# Altium schematic sheet STM32F405.SchDoc
size 406 x 381 mm; SheetNumber: 3; SheetTotal: 3
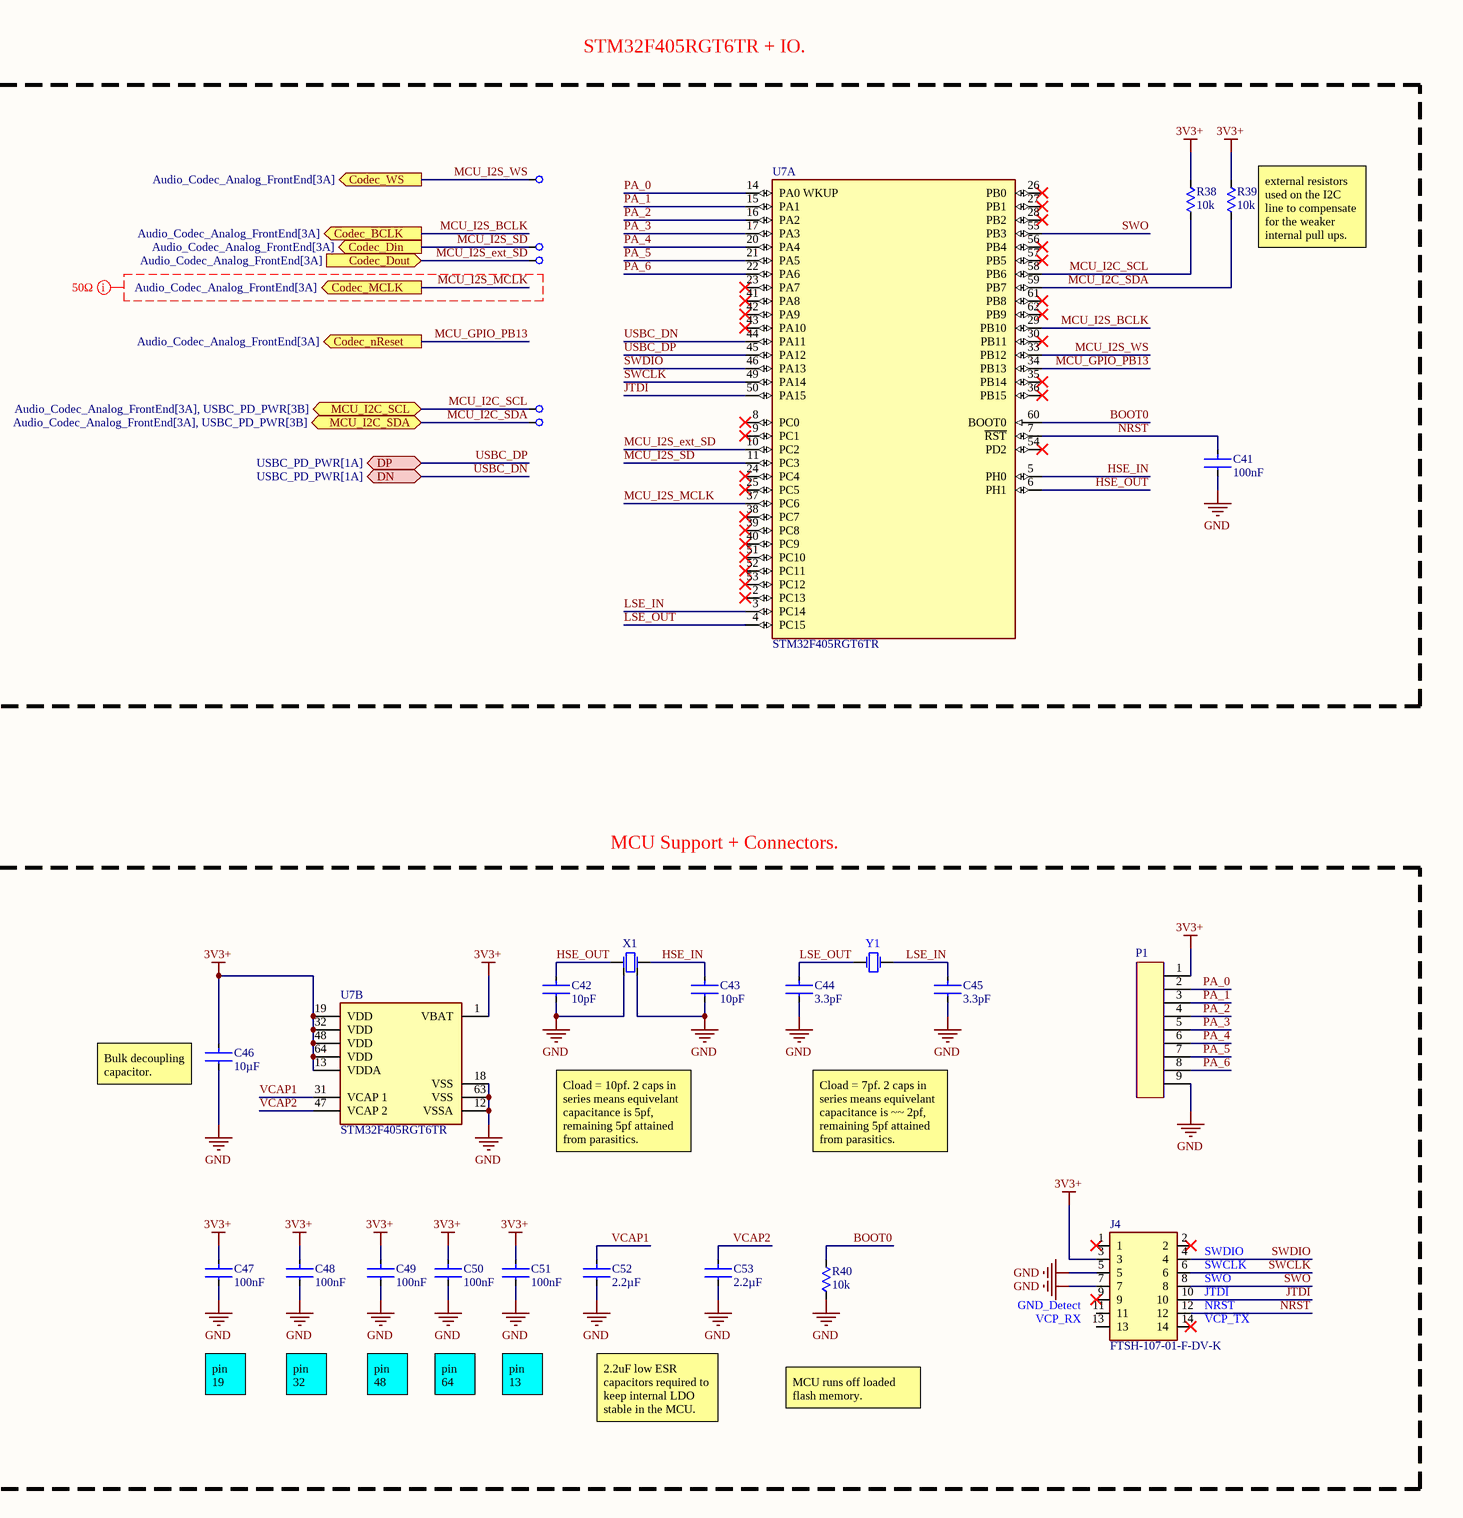
[diagram p0: STM32F405.SchDoc, left]
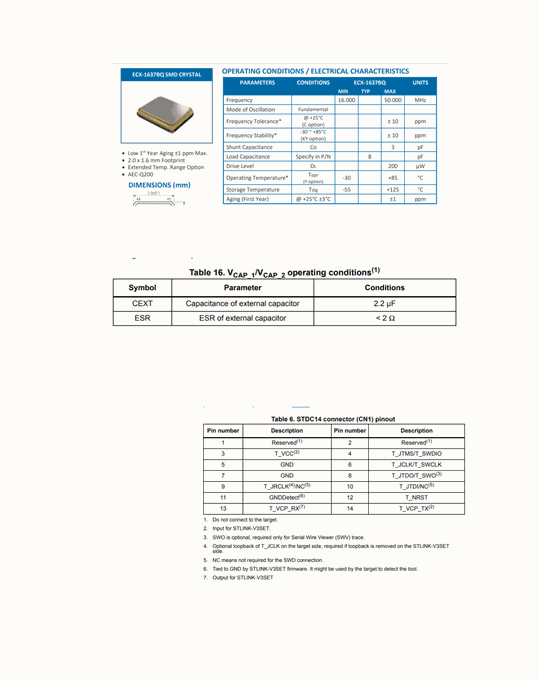
[diagram p1: STM32F405.SchDoc, right]

## Parts
C41  value 100nF  [MURATA-G_M188]  (hidden comment: GCM188R71H104KA57D)
C42  value 10pF  [FP-CL10-MFG]  (hidden comment: CL10C100CB81PNC)
C43  value 10pF  [FP-CL10-MFG]  (hidden comment: CL10C100CB81PNC)
C44  value 3.3pF  [MURATA-G_M188]  (hidden comment: GCM1885C2A3R3CA16D)
C45  value 3.3pF  [MURATA-G_M188]  (hidden comment: GCM1885C2A3R3CA16D)
C46  value 10µF  [MURATA-G_M21B]  (hidden comment: GCM21BC71E106KE36L)
C47  value 100nF  [MURATA-G_M188]  (hidden comment: GCM188R71H104KA57D)
C48  value 100nF  [MURATA-G_M188]  (hidden comment: GCM188R71H104KA57D)
C49  value 100nF  [MURATA-G_M188]  (hidden comment: GCM188R71H104KA57D)
C50  value 100nF  [MURATA-G_M188]  (hidden comment: GCM188R71H104KA57D)
C51  value 100nF  [MURATA-G_M188]  (hidden comment: GCM188R71H104KA57D)
C52  value 2.2µF  [FP-CL10-MFG]  (hidden comment: CL10A225KA8NNNC)
C53  value 2.2µF  [FP-CL10-MFG]  (hidden comment: CL10A225KA8NNNC)
J4  FTSH-107-01-F-DV-K  [FP-FTSH-107-01-F-DV-K-MFG]
P1  61300911121  [61300911121]  (value not drawn)
R38  value 10k  [VISHAY-CRCW0603]  (hidden comment: CRCW060310K0FKTA)
R39  value 10k  [VISHAY-CRCW0603]  (hidden comment: CRCW060310K0FKTA)
R40  value 10k  [VISHAY-CRCW0603]  (hidden comment: CRCW060310K0FKTA)
TP10  Testpoint 1mm  [Testpoint 1mm]  (value not drawn)
TP11  Testpoint 1mm  [Testpoint 1mm]  (value not drawn)
TP12  Testpoint 1mm  [Testpoint 1mm]  (value not drawn)
TP13  Testpoint 1mm  [Testpoint 1mm]  (value not drawn)
TP27  Testpoint 1mm  [Testpoint 1mm]  (value not drawn)
U7  STM32F405RGT6TR  [FP-LQFP64-5W-IPC_C]  (parts A,B of 2)
X1  ECS-250-10-37BQ-CTN-TR  [ECX-1637BQ-ECS]  (value not drawn)
Y1  ECS-.327-7-34QCS-TR  [ECX-34Q-ECS]  (value not drawn)

## Blocks framed on the sheet
MCU Support + Connectors.: C42-C53 J4 P1 R40 U7 X1 Y1

## Ports
Codec_BCLK (out, see Audio_Codec_Analog_FrontEnd[3A]), Codec_Din (out, see Audio_Codec_Analog_FrontEnd[3A]), Codec_Dout (in, see Audio_Codec_Analog_FrontEnd[3A]), Codec_MCLK (out, see Audio_Codec_Analog_FrontEnd[3A]), Codec_nReset (out, see Audio_Codec_Analog_FrontEnd[3A]), Codec_WS (out, see Audio_Codec_Analog_FrontEnd[3A]), DN (bidir, see USBC_PD_PWR[1A]), DP (bidir, see USBC_PD_PWR[1A]), MCU_I2C_SCL (bidir, see Audio_Codec_Analog_FrontEnd[3A], USBC_PD_PWR[3B]), MCU_I2C_SDA (bidir, see Audio_Codec_Analog_FrontEnd[3A], USBC_PD_PWR[3B])

## Nets
3V3+: C46.1 C47.1 C48.1 C49.1 C50.1 C51.1 J4.3 P1.1 R38.2 R39.2 U7.1(VBAT) U7.13(VDDA) U7.19(VDD) U7.32(VDD) U7.48(VDD) U7.64(VDD)
GND: C41.2 C42.2 C43.2 C44.2 C45.2 C46.2 C47.2 C48.2 C49.2 C50.2 C51.2 C52.2 C53.2 J4.5 J4.7 P1.9 R40.2 U7.12(VSSA) U7.18(VSS) U7.63(VSS) X1.2(GND) X1.4(GND)
BOOT0: R40.1 U7.60(BOOT0)
HSE_IN: C43.1 U7.5(PH0) X1.3(Out/In)
HSE_OUT: C42.1 U7.6(PH1) X1.1(In/Out)
JTDI: J4.10 U7.50(PA15)
LSE_IN: C45.1 U7.3(PC14) Y1.2
LSE_OUT: C44.1 U7.4(PC15) Y1.1
MCU_GPIO_PB13: U7.34(PB13) ; port Codec_nReset
MCU_I2C_SCL: R38.1 TP13.1 U7.58(PB6) ; port MCU_I2C_SCL
MCU_I2C_SDA: R39.1 TP27.1 U7.59(PB7) ; port MCU_I2C_SDA
MCU_I2S_BCLK: U7.29(PB10) ; port Codec_BCLK
MCU_I2S_ext_SD: TP12.1 U7.10(PC2) ; port Codec_Dout
MCU_I2S_MCLK: U7.37(PC6) ; port Codec_MCLK
MCU_I2S_SD: TP11.1 U7.11(PC3) ; port Codec_Din
MCU_I2S_WS: TP10.1 U7.33(PB12) ; port Codec_WS
NRST: C41.1 J4.12 U7.7(~{RST})
PA_0: P1.2 U7.14(PA0_WKUP)
PA_1: P1.3 U7.15(PA1)
PA_2: P1.4 U7.16(PA2)
PA_3: P1.5 U7.17(PA3)
PA_4: P1.6 U7.20(PA4)
PA_5: P1.7 U7.21(PA5)
PA_6: P1.8 U7.22(PA6)
SWCLK: J4.6 U7.49(PA14)
SWDIO: J4.4 U7.46(PA13)
SWO: J4.8 U7.55(PB3)
USBC_DN: U7.44(PA11) ; port DN
USBC_DP: U7.45(PA12) ; port DP
VCAP1: C52.1 U7.31(VCAP_1)
VCAP2: C53.1 U7.47(VCAP_2)

Not connected (* = marked no-connect by the designer): J4 1* 2* 9* 11 13 14*; U7 2(PC13)* 8(PC0)* 9(PC1)* 23(PA7)* 24(PC4)* 25(PC5)* 26(PB0)* 27(PB1)* 28(PB2)* 30(PB11)* 35(PB14)* 36(PB15)* 38(PC7)* 39(PC8)* 40(PC9)* 41(PA8)* 42(PA9)* 43(PA10)* 51(PC10)* 52(PC11)* 53(PC12)* 54(PD2)* 56(PB4)* 57(PB5)* 61(PB8)* 62(PB9)*

## Layout directives
net class 50Ω: MCU_I2S_MCLK

## Notes on the sheet
- STM32F405RGT6TR + IO.
- (near R39) external resistors used on the I2C line to compensate for the weaker internal pull ups.
- (near C46) Bulk decoupling capacitor.
- Cload = 10pf. 2 caps in series means equivelant capacitance is 5pf, remaining 5pf attained from parasitics.
- Cload = 7pf. 2 caps in series means equivelant capacitance is ~~ 2pf, remaining 5pf attained from parasitics.
- (near J4) SWDIO
- (near J4) VCP_RX
- (near J4) GND_Detect
- (near J4) SWCLK
- (near J4) SWO
- (near J4) JTDI
- (near J4) NRST
- (near J4) VCP_TX
- pin 19
- pin 32
- pin 48
- pin 64
- pin 13
- 2.2uF low ESR capacitors required to keep internal LDO stable in the MCU.
- MCU runs off loaded flash memory.

## Library data of the parts
C41 C47-C51 = CMP-001-00243-4: 0.1 µF ±10% 50V Ceramic Capacitor X7R 0603 (1608 Metric); Pins: 2; Temperature Code: X7R; Mounting Technology: Surface Mount; Capacitor Type: Ceramic; Case/Package: 0603; RoHS Compliant: Yes; Tolerance: 10%; Voltage Rating: 50V
C42 C43 = CMP-001-00067-3: 10 pF ±0.25pF 50V Ceramic Capacitor C0G, NP0 0603 (1608 Metric); Tolerance: 2.5%; Max Operating Temperature: 125°C; Pins: 2; Voltage Rating: 50V; RoHS Compliant: Yes; Mounting Technology: Surface Mount; Min Operating Temperature: -55°C; Case/Package: 0603; Capacitor Type: Ceramic
C44 C45 = CMP-001-01629-3: Voltage Rating: 100V; Tolerance: 8%; Capacitor Type: Ceramic; Temperature Code: C0G; Pins: 2; RoHS Compliant: Yes; Mounting Technology: Surface Mount; Case/Package: 0603
C46 = CMP-001-02049-3: 10 µF ±10% 25V Ceramic Capacitor X7S 0805 (2012 Metric); Capacitor Type: Ceramic; Mounting Technology: Surface Mount; Min Operating Temperature: 125°C; Case/Package: 0805; Voltage Rating: 25V; Temperature Code: X7S; Tolerance: 10%; Pins: 2; Max Operating Temperature: -55°C
C52 C53 = CMP-001-00072-7: 2.2 µF ±10% 25V Ceramic Capacitor X5R 0603 (1608 Metric); Min Operating Temperature: -55°C; Capacitor Type: Ceramic; Case/Package: 0603; Max Operating Temperature: 85°C; Mounting Technology: Surface Mount; RoHS Compliant: Yes; Pins: 2
J4 = CMP-002-00009-3: Board Connector, 14 Contact(s), 2 Row(s), Male, Straight, 0.05 inch Pitch, Surface Mount Terminal, Locking; Connector Type: BOARD CONNECTOR; RoHS Compliant: Yes; Mounting Technology: Board
P1 = CMP-002-00072-1: Board Connector, 9 Contact(s), 1 Row(s), Male, Straight, 0.1 inch Pitch, Solder Terminal, Locking, Black Insulator, Plug; Max Operating Temperature: 125°C; Mounting Technology: Board; Min Operating Temperature: -40°C; Connector Type: BOARD CONNECTOR; RoHS Compliant: Yes
R38-R40 = CMP-009-00002-7: 10 kOhms ±1% 0.1W, 1/10W Chip Resistor 0603 (1608 Metric) Automotive AEC-Q200 Thick Film; Power: 100mW; Voltage Rating: 75V; Max Operating Temperature: 155°C; Pins: 2; Min Operating Temperature: -55°C; RoHS Compliant: No; Tolerance: 1%; Case/Package: 0603; Mounting Technology: Surface Mount
TP10-TP13 TP27 = CMP-00030-00004-4: Labelled 1mm testpoint pad
U7 = CMP-0243-00156-2: IC MCU 32BIT 1MB FLASH 64LQFP; Frequency: 168MHz; Number of SPI Channels: 3; Oscillator Type: Internal; Core Architecture: ARM; Number of UART Channels: 2; Max Supply Voltage: 3.6V; Watchdog Timer: Yes; RAM Size: 196KB; Interface: I2C; Max Power Dissipation: 435mW; Number of Timers/Counters: 14; Data Bus Width: 32b; Peripherals: Brown-out Detect/Reset; Number of ADC Channels: 16; Min Supply Voltage: 1.8V; Number of Programmable I/O: 51; Memory Size: 1024KB; Max Operating Temperature: 85°C; Package Quantity: 1000; Lead Free: Lead Free; Memory Type: FLASH; Case/Package: LQFP; Number of I2C Channels: 3; Contact Plating: Tin; Mount: Surface Mount; Min Operating Temperature: -40°C; Radiation Hardening: No; Number of USB Channels: 2; Packaging: Tape and Reel; Height: 1.45mm; Number of Pins: 64; Number of I/Os: 51; Max Frequency: 168MHz; Width: 10mm; Length: 10mm
X1 = CMP-003-00007-1: 25 MHz ±10ppm Crystal 10pF 50 Ohms, Automotive AEC-Q200, 4-SMD, No Lead; ESR: 50; Frequency: 25MHz; Min Operating Temperature: -40°C; Load Capacitance: 10pF; RoHS Compliant: Yes; Pins: 4; Mounting Technology: Surface Mount; Max Operating Temperature: 85°C
Y1 = CMP-003-00006-2: 32.768 kHz ±10ppm Crystal 7pF 70 kOhms, Automotive AEC-Q200, 2-SMD, No Lead; ESR: 70k; Max Operating Temperature: 125°C; Min Operating Temperature: -40°C; Frequency: 32.768kHz; Load Capacitance: 7pF; RoHS Compliant: Yes; Mounting Technology: Surface Mount; Pins: 2